# Altium schematic sheet IR.SchDoc
size A4
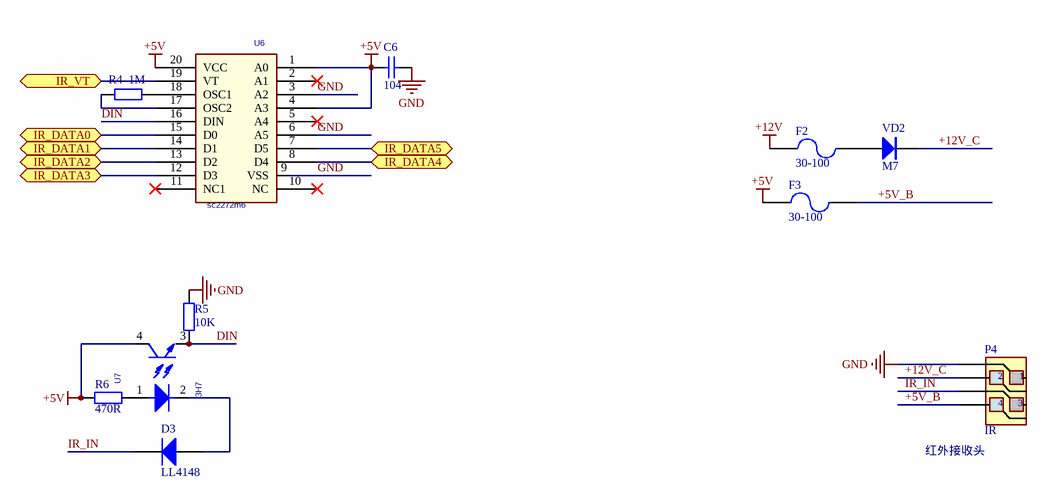
[diagram p0: IR.SchDoc]

## Parts
C6  104  [C 0805]
D3  LL4148  [MINI_MELF (LL34)]
F2  30-100  [FU 1812]
F3  30-100  [FU 1812]
P4  IR  [557-2x2]
R4  1M  [R 0805]
R5  10K  [R 0805]
R6  470R  [R 0805]
U6  sc2272m6  [SOP20_N]
U7  3H7  [SOP4_3H7]
VD2  M7  [SMA]

## Ports
IR_DATA0 (bidir), IR_DATA1 (bidir), IR_DATA2 (bidir), IR_DATA3 (bidir), IR_DATA4 (bidir), IR_DATA5 (bidir), IR_VT (bidir)

## Nets
+5V: C6.2 F3.1 R6.2 U6.1(A0) U6.4(A3) U6.20(VCC) U7.4(COLLECTOR)
+12V: F2.1
GND: C6.1 P4.1 R5.2 U6.3(A2) U6.6(A5) U6.9(VSS)
+5V_B: F3.2 P4.4
+12V_C: P4.2 VD2.2(K)
DIN: R5.1 U6.16(DIN) U7.3(EMITTER)
IR_DATA0: U6.15(D0) ; port IR_DATA0
IR_DATA1: U6.14(D1) ; port IR_DATA1
IR_DATA2: U6.13(D2) ; port IR_DATA2
IR_DATA3: U6.12(D3) ; port IR_DATA3
IR_DATA4: U6.8(D4) ; port IR_DATA4
IR_DATA5: U6.7(D5) ; port IR_DATA5
IR_IN: D3.2 P4.3
IR_VT: U6.19(VT) ; port IR_VT
NetD3_1: D3.1 U7.2(CATHODE)
NetF2_2: F2.2 VD2.1(A)
NetR4_1: R4.1 U6.17(OSC2)
NetR4_2: R4.2 U6.18(OSC1)
NetR6_1: R6.1 U7.1(ANODE)

Not connected (* = marked no-connect by the designer): U6 2(A1)* 5(A4)* 10(NC)* 11(NC1)*

## Notes on the sheet
- (near P4) 红外接收头
- 设 计
- 制 图
- 审 核
- 类 别
- 签  字
- 日 期
- 产 品
- 名 称
- 零 件
- 板  名
- 数  量
- 共  张
- 第  张
- 批 准
- 文件编号
- 沈阳市创奇游乐设备有限公司

## Library data of the parts
C6 = Cap1
D3 = Diode
F2 F3 = Fuse 2: Fuse; Published: 8-Jun-2000; LatestRevisionDate: 17-Jul-2002; LatestRevisionNote: Re-released for DXP Platform.; PackageReference: PIN-W2/E2.8; Publisher: Altium Limited
P4 = 557-2x2: 接插件
R4 = Res2: Resistor; Published: 8-Jun-2000; LatestRevisionDate: 17-Jul-2002; LatestRevisionNote: Re-released for DXP Platform.; Publisher: Altium Limited
R5 R6 = Res1
U6 = PT2272_L6S
U7 = PS2801-1/SM
VD2 = M7: 整流二极管; 版权归属: 源创客; BOM名称: 整流二极管; 学习资源: www.ooocke.com